# Altium schematic sheet nbiot&gps.SchDoc
size A3
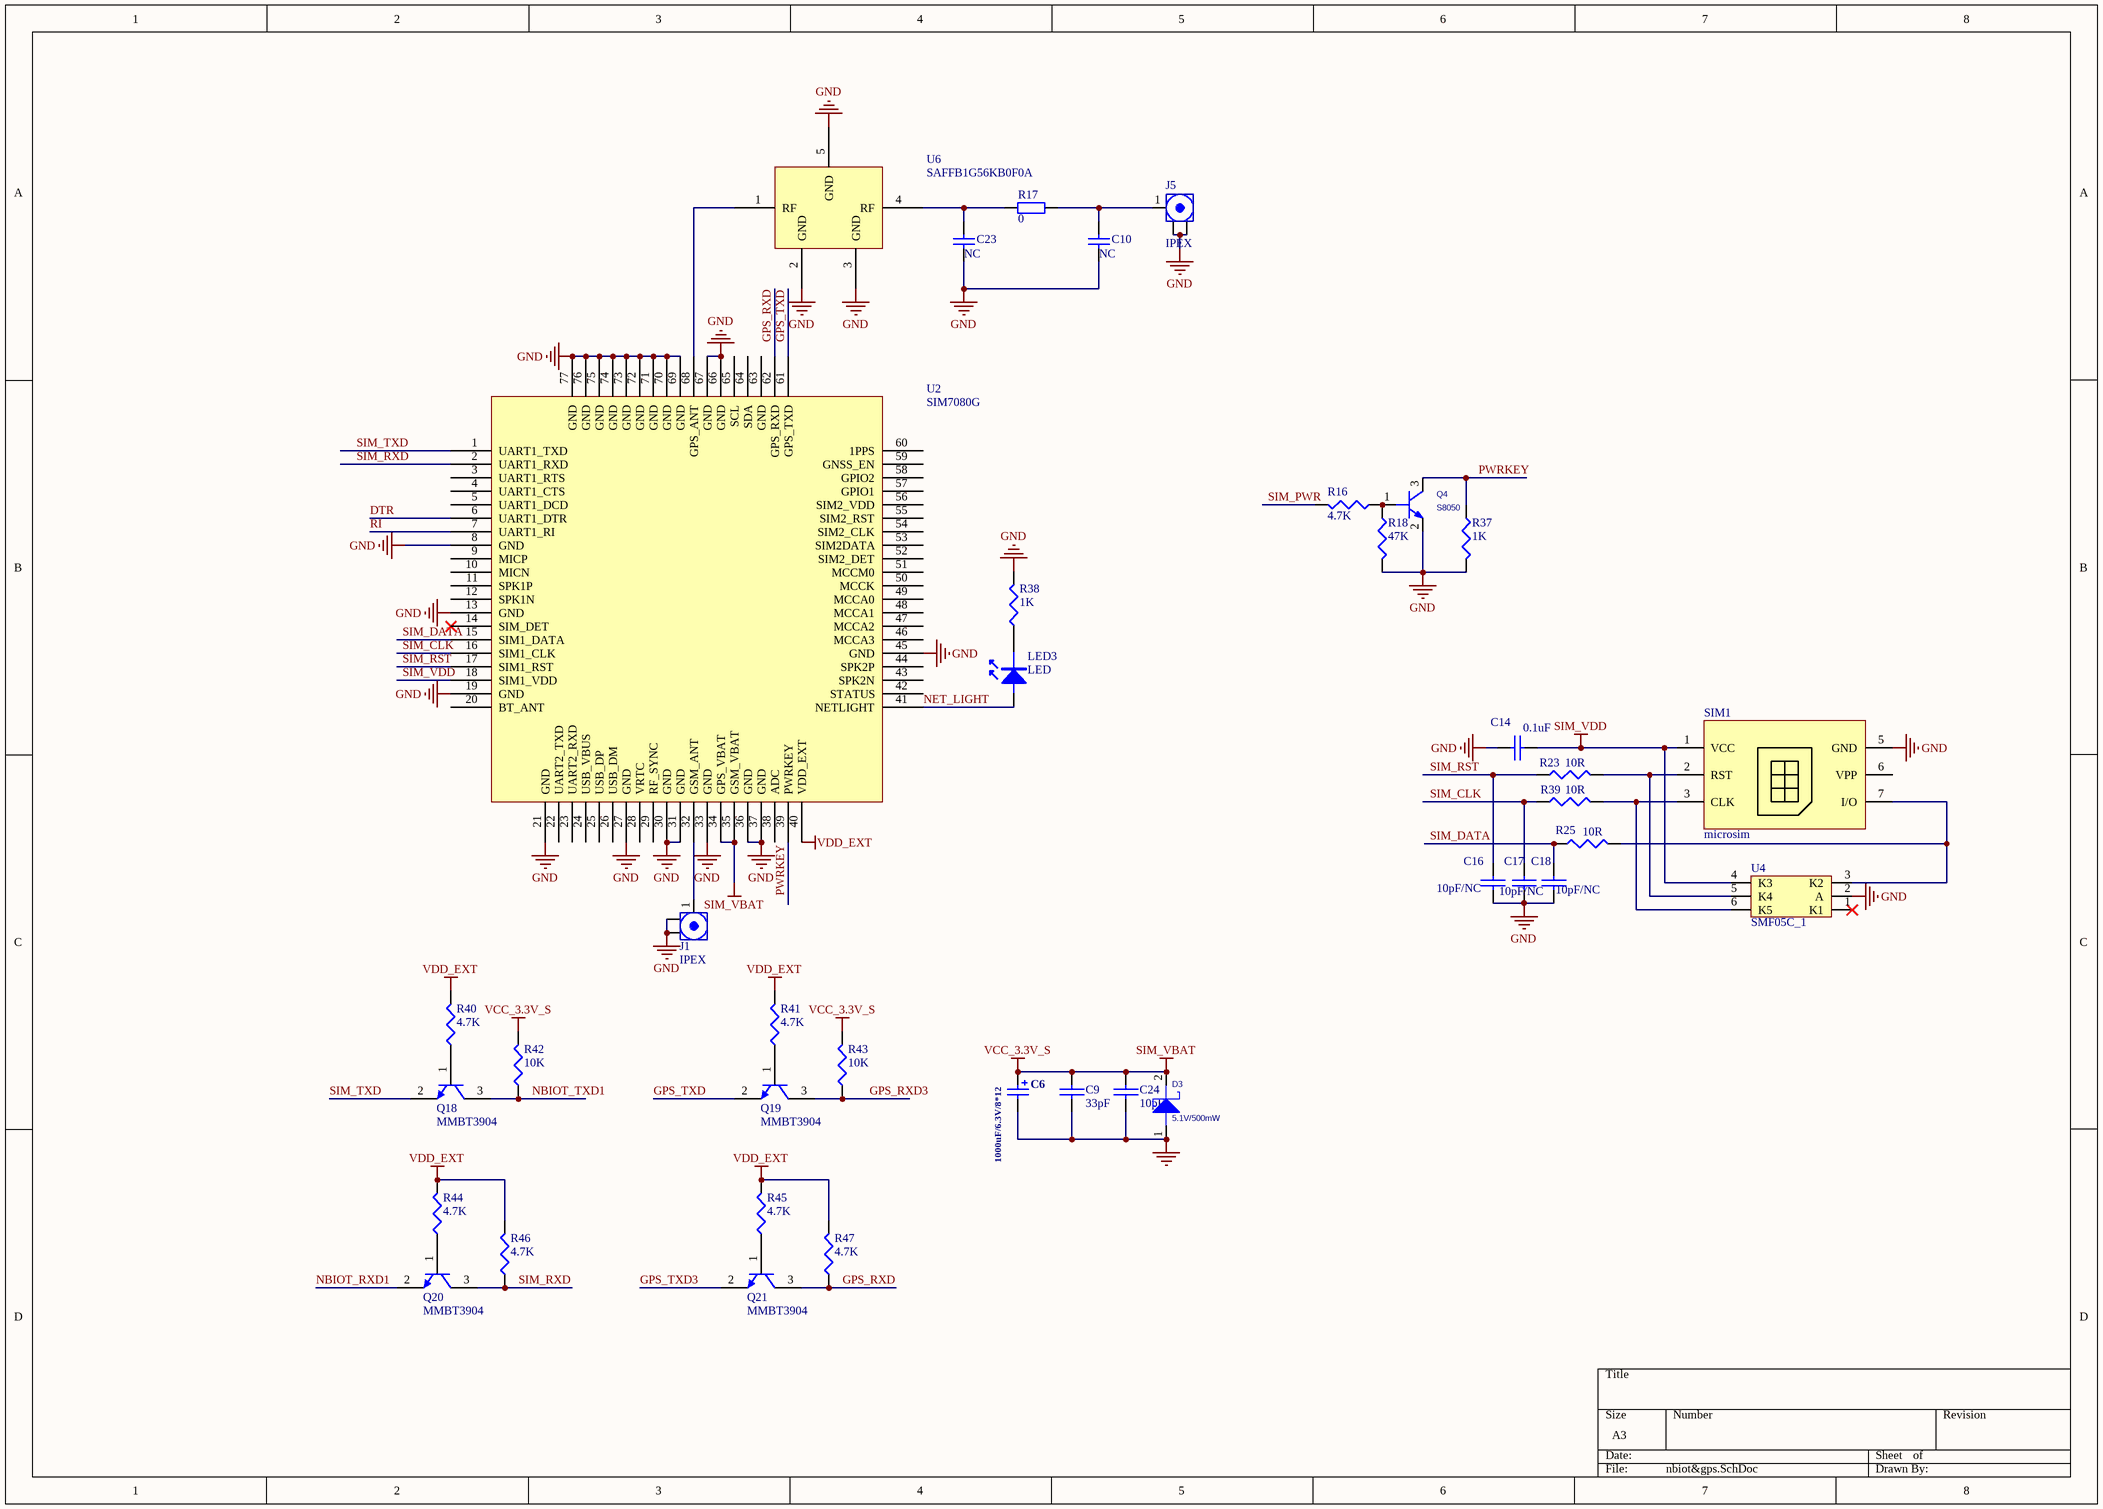
[diagram p0: nbiot&gps.SchDoc]

## Parts
C6  1000uF/6.3V/8*12  [8*12]
C9  33pF  [0603C]
C10  NC  [0603C]
C14  0.1uF  [0603C]
C16  10pF/NC  [0603C]
C17  10pF/NC  [0603C]
C18  10pF/NC  [0603C]
C23  NC  [0603C]
C24  10pF  [0603C]
D3  value 5.1V/500mW  [LL-34(D1206)]  (hidden comment: DIODE_SCHOTTKY_0)
J1  IPEX  [RF-UFL]
J5  IPEX  [RF-UFL]
LED3  LED  [0603LED]
Q4  S8050  [SOT23]
Q18  MMBT3904  [SOT23-3]
Q19  MMBT3904  [SOT23-3]
Q20  MMBT3904  [SOT23-3]
Q21  MMBT3904  [SOT23-3]
R16  4.7K  [0603R]
R17  0  [0603R]
R18  47K  [0603R]
R23  10R  [0603R]
R25  10R  [0603R]
R37  1K  [0603R]
R38  1K  [0603R]
R39  10R  [0603R]
R40  4.7K  [0603R]
R41  4.7K  [0603R]
R42  10K  [0603R]
R43  10K  [0603R]
R44  4.7K  [0603R]
R45  4.7K  [0603R]
R46  4.7K  [0603R]
R47  4.7K  [0603R]
SIM1  microsim  [Nano SIM]
U2  SIM7080G  [SIM868]
U4  SMF05C_1  [SC70-6L]
U6  SAFFB1G56KB0F0A  [SAFFB1G56KB0F0A]

## Nets
GND: C6.2 C9.1 C10.2 C14.1 C16.1 C17.1 C18.1 C23.2 C24.1 D3.1 J1.2(Y) J5.2(Y) Q4.2(E) R18.2 R37.2 R38.2 SIM1.5(GND) U2.8(GND) U2.13(GND) U2.19(GND) U2.21(GND) U2.27(GND) U2.30(GND) U2.31(GND) U2.33(GND) U2.36(GND) U2.37(GND) U2.45(GND) U2.66(GND) U2.67(GND) U2.69(GND) U2.70(GND) U2.71(GND) U2.72(GND) U2.73(GND) U2.74(GND) U2.75(GND) U2.76(GND) U2.77(GND) U4.2(A) U6.2(GND) U6.3(GND) U6.5(GND)
SIM_VBAT: C6.1 C9.2 C24.2 D3.2 R42.2 R43.2 U2.34(GPS_VBAT) U2.35(GSM_VBAT)  [also labelled VCC_3.3V_S]
SIM_VDD: C14.2 SIM1.1(VCC) U2.18(SIM1_VDD) U4.4(K3)
VDD_EXT: R40.2 R41.2 R44.2 R45.2 R46.2 R47.2 U2.40(VDD_EXT)
DTR: U2.6(UART1_DTR)
GPS_RXD: Q21.3(C) R47.1 U2.62(GPS_RXD)
GPS_RXD3: Q19.3(C) R43.1
GPS_TXD: Q19.2(E) U2.61(GPS_TXD)
GPS_TXD3: Q21.2(E)
NBIOT_RXD1: Q20.2(E)
NBIOT_TXD1: Q18.3(C) R42.1
NET_LIGHT: LED3.1 U2.41(NETLIGHT)
PWRKEY: Q4.3(C) R37.1 U2.39(PWRKEY)
RI: U2.7(UART1_RI)
SIM_CLK: C17.2 R39.1 U2.16(SIM1_CLK)
SIM_DATA: C18.2 R25.1 U2.15(SIM1_DATA)
SIM_PWR: R16.2
SIM_RST: C16.2 R23.1 U2.17(SIM1_RST)
SIM_RXD: Q20.3(C) R46.1 U2.2(UART1_RXD)
SIM_TXD: Q18.2(E) U2.1(UART1_TXD)
NetC10_1: C10.1 J5.1(X) R17.2
NetC23_1: C23.1 R17.1 U6.4(RF)
NetJ1_1: J1.1(X) U2.32(GSM_ANT)
NetLED3_2: LED3.2 R38.1
NetQ4_1: Q4.1(B) R16.1 R18.1
NetQ18_1: Q18.1(B) R40.1
NetQ19_1: Q19.1(B) R41.1
NetQ20_1: Q20.1(B) R44.1
NetQ21_1: Q21.1(B) R45.1
NetR23_2: R23.2 SIM1.2(RST) U4.5(K4)
NetR25_2: R25.2 SIM1.7(I/O) U4.3(K2)
NetR39_2: R39.2 SIM1.3(CLK) U4.6(K5)
NetU2_68: U2.68(GPS_ANT) U6.1(RF)

Not connected (* = marked no-connect by the designer): SIM1 6(VPP); U2 3(UART1_RTS) 4(UART1_CTS) 5(UART1_DCD) 9(MICP) 10(MICN) 11(SPK1P) 12(SPK1N) 14(SIM_DET)* 20(BT_ANT) 22(UART2_TXD) 23(UART2_RXD) 24(USB_VBUS) 25(USB_DP) 26(USB_DM) 28(VRTC) 29(RF_SYNC) 38(ADC) 42(STATUS) 43(SPK2N) 44(SPK2P) 46(MCCA3) 47(MCCA2) 48(MCCA1) 49(MCCA0) 50(MCCK) 51(MCCM0) 52(SIM2_DET) 53(SIM2DATA) 54(SIM2_CLK) 55(SIM2_RST) 56(SIM2_VDD) 57(GPIO1) 58(GPIO2) 59(GNSS_EN) 60(1PPS) 63(GND) 64(SDA) 65(SCL); U4 1(K1)*

## Library data of the parts
C6 = Cap Pol3: Polarized Capacitor (Surface Mount); PackageReference: C10*10.2
C9 C14 C16-C18 C24 = CAP: Capacitor
C10 C23 = Cap: Capacitor; Value: 0.1uF/10V; Published: 8-Jun-2000; LatestRevisionDate: 17-Jul-2002; LatestRevisionNote: Re-released for DXP Platform.; PackageReference: RAD-0.3; Publisher: Altium Limited
D3 = DIODE_SCHOTTKY_0: PCB DECAL: DO_214AC; Source_Path: E:\AIH\WORK\A\LIBRARY1.OLB
J1 J5 = ANT
Q4 = 2N1069_1: PspiceTemplate: Q^@REFDES %C %B %E
Q18-Q21 = NPN
R16 R18 R23 R25 R37-R47 = RES1: P: 1/8W
R17 = Res2: Resistor; Published: 8-Jun-2000; LatestRevisionDate: 17-Jul-2002; LatestRevisionNote: Re-released for DXP Platform.; PackageReference: AXIAL-0.4; Publisher: Altium Limited; Value: 0
U2 = SIM868E/SIM868
U4 = SMF05C_1: TVS
U6 = SAFFB1G56KBOFA